# EAGLE design barometer (EAGLE 7.0.0)
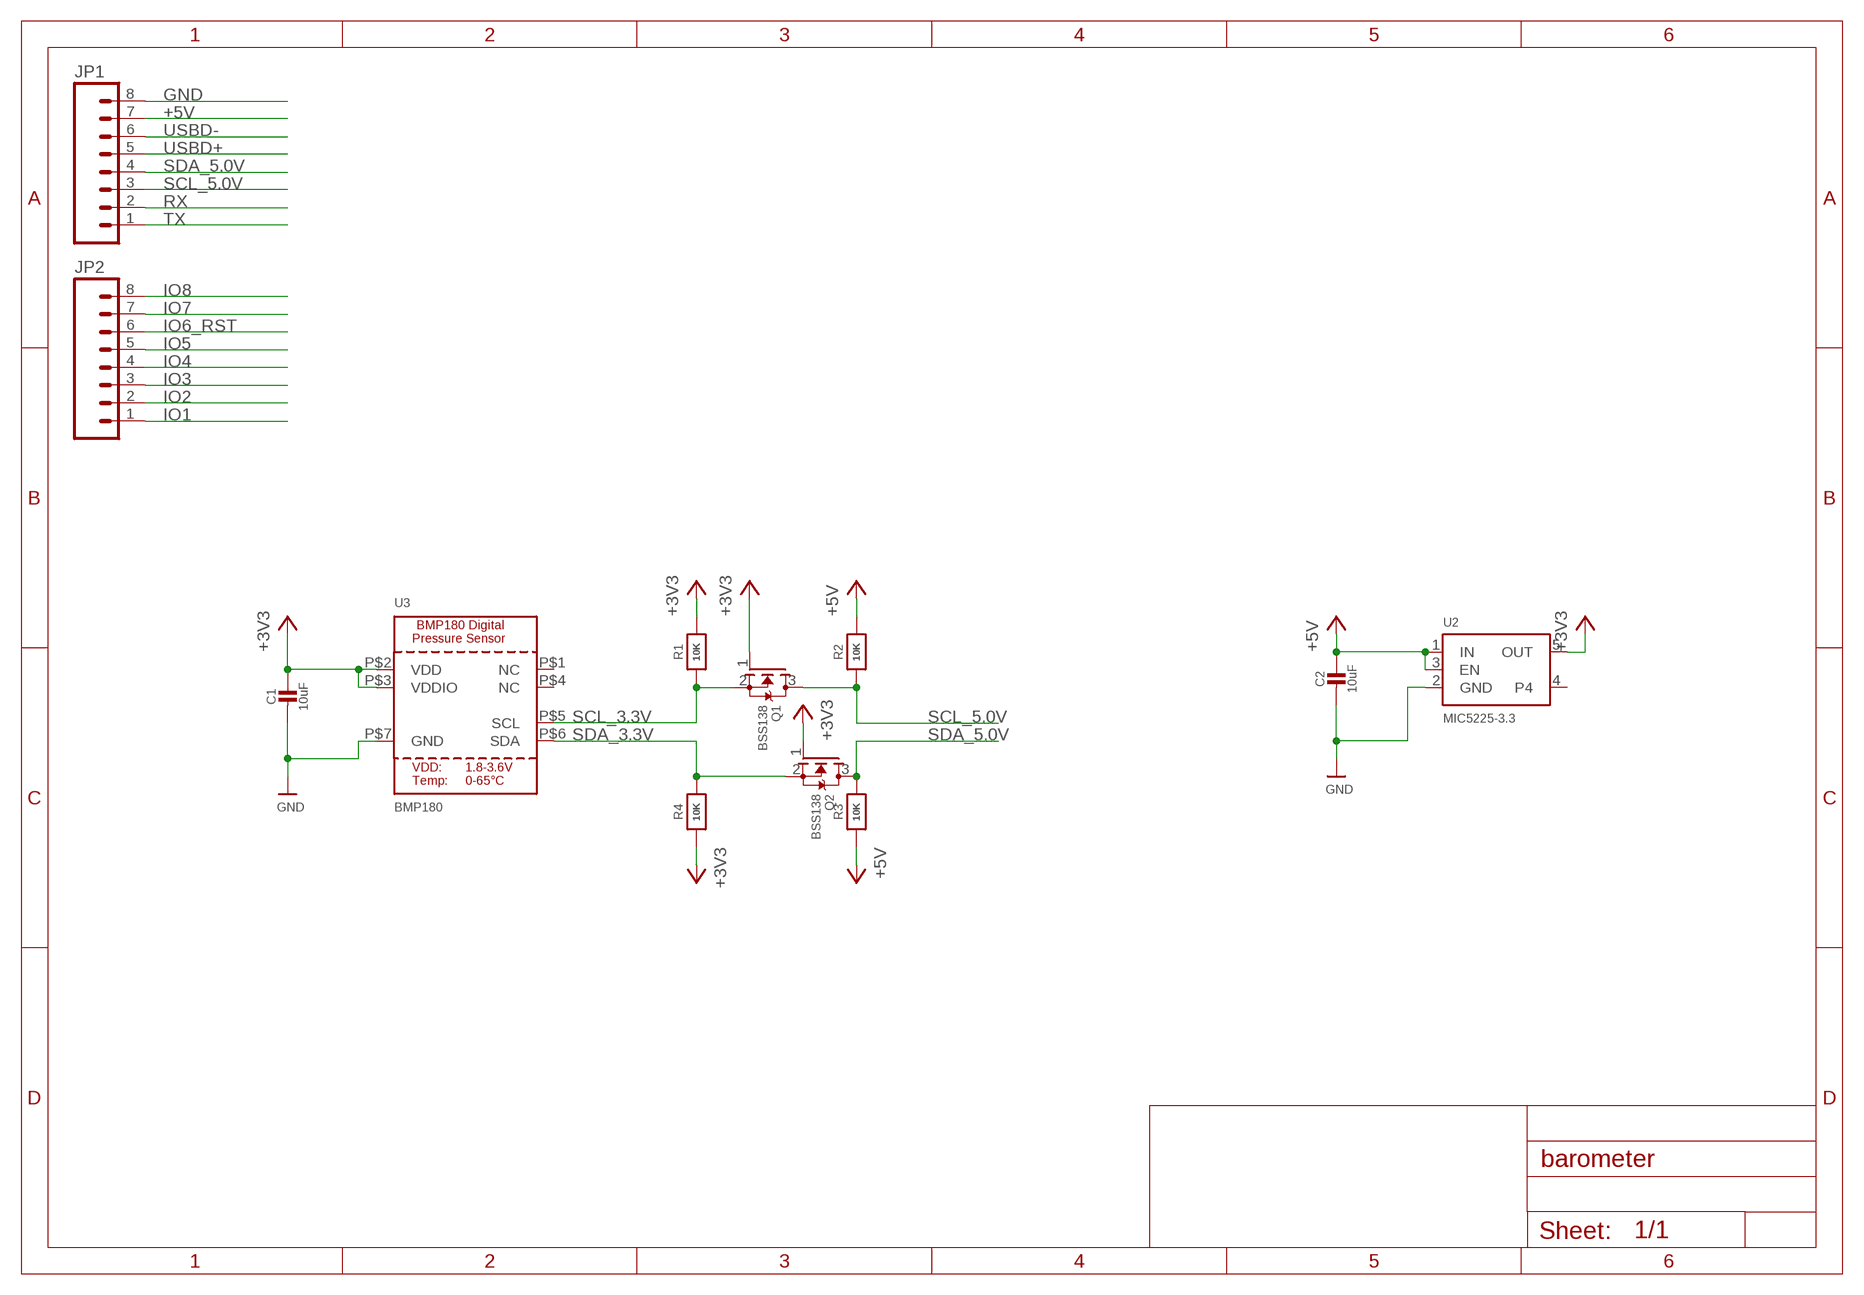
[diagram p0: schematic, sheet 1]

## Parts
C1  10uF  CAP_CERAMIC0805-NOOUTLINE  [0805-NO]
C2  10uF  CAP_CERAMIC0805-NOOUTLINE  [0805-NO]
JP1  M081X08  [1X08]
JP2  M081X08  [1X08]
Q1  BSS138  MOSFET-NREFLOW  [SOT23]
Q2  BSS138  MOSFET-NREFLOW  [SOT23]
R1  10K  RESISTOR0805_NOOUTLINE  [0805-NO]
R2  10K  RESISTOR_0805MP  [_0805MP]
R3  10K  RESISTOR0805_NOOUTLINE  [0805-NO]
R4  10K  RESISTOR0805_NOOUTLINE  [0805-NO]
U2  MIC5225-3.3  VREG_SOT23-5  [SOT23-5]
U3  BMP180  BMP180EXT  [BMP180_EXTENDED]

## Nets
+3V3: C1.1 Q1.1(G) Q2.1(G) R1.2 R4.1 U2.5(OUT) U3.P$2(VDD) U3.P$3(VDDIO)
+5V: C2.1 JP1.7 R2.2 R3.1 U2.1(IN) U2.3(EN)
GND: C1.2 C2.2 JP1.8 U2.2(GND) U3.P$7(GND)
IO1: JP2.1
IO2: JP2.2
IO3: JP2.3
IO4: JP2.4
IO5: JP2.5
IO6_RST: JP2.6
IO7: JP2.7
IO8: JP2.8
RX: JP1.2
SCL_3.3V: Q1.2(S) R1.1 U3.P$5(SCL)
SCL_5.0V: JP1.3 Q1.3(D) R2.1
SDA_3.3V: Q2.2(S) R4.2 U3.P$6(SDA)
SDA_5.0V: JP1.4 Q2.3(D) R3.2
TX: JP1.1
USBD+: JP1.5
USBD-: JP1.6
Unconnected: U2.4 U3.P$1(NC) U3.P$4(NC)

## Library data of the parts
C1 C2 = microbuilder:CAP_CERAMIC: Ceramic Capacitors For new designs, use the packages preceded by an '_' character since they are more reliable: The following footprints should be used on most boards: _0402 - Standard footprint for regular board layouts _0603 - Standard footprint for regular board layouts _0805 - Standard footprint for regular board layouts _1206 - Standard footprint for regular board layouts For extremely tight-pitch boards where space is at a premium, the following 'micro-pitch' footprints can be used (smaller pads, no silkscreen outline, etc.): _0402MP - Micro-pitch footprint for very dense/compact boards _0603MP - Micro-pitch footprint for very dense/compact boards _0805MP - Micro-pitch footprint for very dense/compact boards _1206MP - Micro-pitch footprint for very dense/compact boards
JP1 JP2 = SparkFun-Connectors:M08: Header 8 Standard 8-pin 0.1" header. Use with straight break away headers (SKU : PRT-00116), right angle break away headers (PRT-00553), swiss pins (PRT-00743), machine pins (PRT-00117), and female headers (PRT-00115).
Q1 Q2 = adafruit:MOSFET-N: N-Channel Mosfet 2N7002E - 60V 260mA SOT23 [Digikey: 2N7002ET1GOSTR-ND] - REEL BSH103 - 30V 850mA SOT23 [Digikey: 568-5013-1-ND]
R1-R4 = microbuilder:RESISTOR: Resistors For new designs, use the packages preceded by an '_' character since they are more reliable: The following footprints should be used on most boards: _0402 - Standard footprint for regular board layouts _0603 - Standard footprint for regular board layouts _0805 - Standard footprint for regular board layouts _1206 - Standard footprint for regular board layouts For extremely tight-pitch boards where space is at a premium, the following 'micro-pitch' footprints can be used (smaller pads, no silkscreen outline, etc.): _0402MP - Micro-pitch footprint for very dense/compact boards _0603MP - Micro-pitch footprint for very dense/compact boards _0805MP - Micro-pitch footprint for very dense/compact boards _1206MP - Micro-pitch footprint for very dense/compact boards
U2 = microbuilder:VREG_SOT23-5: SOT23-5 Fixed Voltage Regulators Part Current Out V Out V In V Dropout θJA (°C/W) TJ (°C) Digikey Part No. ADP121 150mA 3.3V 3.4-5.5V 0.09V @ 150mA -- -- ADP121-AUJZ33R7CT-ND ADP121 150mA 3.0V 3.1-5.5V 0.09V @ 150mA -- -- ADP121-AUJZ30R7CT-ND ADP122 300mA 3.3V 3.4-5.5V 0.085V @ 300mA -- -- ADP122AUJZ-3.3-R7CT-ND ADP1712 300mA 3.3V 3.5-5.5V 0.17V @ 300mA -- -- ADP1712AUJZ-3.3-R7TR-ND AP7311 (Low Cost) 150mA 3.3V 3.5-6V 0.15V @ 150mA -- -- AP7311-33WG-7DICT-ND LD39015M18R 150mA 1.8V 1.9V-5.5V 0.08V @ 100mA -- -- 497-6977-1-ND LP2985A-33DBVR 150mA 3.3V 3.3-16V 0.28V @ 150mA 206 150 296-18479-1-ND MCP1824T-3302E/OT 300mA 3.3V 3.5V-6V 0.2V @ 300mA -- -- MCP1824T-3302E/OTCT-ND MIC5205-2.5YM5 TR 150mA 2.5V 2.7-16V 0.165V @ 150mA -- -- 576-1257-2-ND MIC5205-3.0YM5 TR 150mA 3.0V 3.2V-16V 0.165V @ 150mA -- -- 576-1258-2-ND MIC5205-3.3YM5 TR 150mA 3.3V 3.5V-16V 0.165V @ 150mA -- -- 576-1259-2-ND TPS780330220 150mA 3.3V+2.2V 3.6-5.5V 250mV Max -- -- 296-23332-1-ND TDA3663/N1,135 100mA 3.3V 3.5-45V 0.18V @ 50mA -- -- 568-5343-1-ND Max operating temp can be calculated using θJA, TJ (max junction temperature), and power in watts. Set the "Maximum Ambient Temperature" until it reaches TJ ("Max Junction Temperature"), which is the absolute limit for safe use of the regulator: Heat Sink Temperature Calculator <http://www.daycounter.com/Calculators/Heat-Sink-Temperature-Calculator.phtml> For example, With 12V source into a 3.3V LP2985 and a 30mA load, we are dissipating (12V-3.3V) * 0.03A = 0.261W. With a θJA of 206 °C/W, a TJ of 150°C, and 261mW we can safely use the chip without a heat sink up to 75°C (=147.1°C Junction Temperature).
U3 = microbuilder:BMP180: BMP180 Digital Pressure Sensor 1.8-3.6V Supply, I2C Interface

## Board
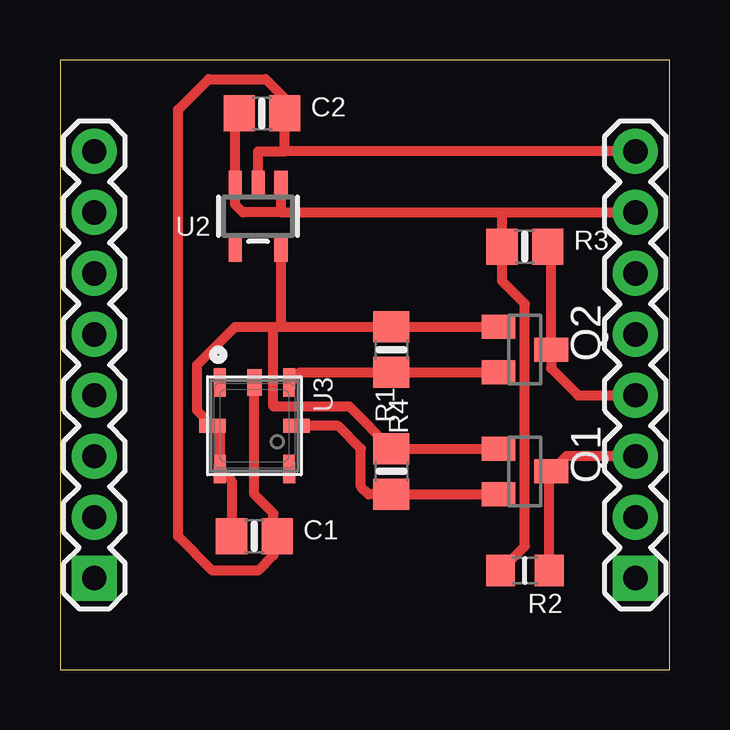
[diagram p1: board, top side]

Size 25.4 x 25.4 mm. Coordinates in mm from the lower left corner, seen from the top.
Outline: 0,0 25.4,0 25.4,25.4 0,25.4 0,0
Copper layers (1*16): Top 0.0356mm / dielectric 1.5011mm / Bottom 0.0356mm
Design rules "LaenPCBOrder": minimum track width 6mil, minimum drill 13mil, track to track 6mil, track to pad 6mil, pad to pad 6mil, via to via 6mil, smd to smd 6mil, copper to edge 15mil, drill to drill 6mil, minimum pad ring 7mil, minimum via ring 7mil, stop-mask expansion 3mil, vias tented up to drill 0mil, thermal gap 10mil

### Footprints (pad centres in the part's own frame; a part is rotated, then mirrored left to right if it is on the bottom)
0805-NO = smd 1.3 x 1.5: 1 -0.95,0; 2 0.95,0
1X08 = drill 1.016 pad 1.88 square: 1 0,0 | drill 1.016 pad 1.88: 2 2.54,0; 3 5.08,0; 4 7.62,0; 5 10.16,0; 6 12.7,0; 7 15.24,0; 8 17.78,0
SOT23 = smd 1 x 1.4: 1 -0.95,-1.1; 2 0.95,-1.1; 3 0,1.1
_0805MP = smd 1.2 x 1.3: 1 -1.016,0; 2 1.016,0
SOT23-5 = smd 0.55 x 1.2: 1 -0.95,-1.3; 2 0,-1.3; 3 0.95,-1.3; 4 0.95,1.3; 5 -0.95,1.3
BMP180_EXTENDED = smd 1.2 x 0.5: P$1 -1.8,-1.45; P$3 1.8,-1.45; P$4 1.8,1.45; P$6 -1.8,1.45 | smd 0.6 x 1.1: P$2 0,-1.75; P$5 0,1.75 | smd 1.1 x 0.6: P$7 -1.8,0

### Placement (x,y rotation side)
C1  8.1,5.56 0 top
C2  8.41,23.18 0 top
JP1  23.97,3.81 90 top
JP2  1.43,3.81 90 top
Q1  19.37,8.26 270 top
Q2  19.37,13.34 270 top
R1  13.81,8.26 90 top
R2  19.37,4.13 180 top
R3  19.37,17.62 0 top
R4  13.81,13.34 270 top
U2  8.26,18.89 180 top
U3  8.1,10.16 270 top

### Tracks (layer width: path | path; a pad name or v marks a point on that pad's centre or on a via)
+3V3
  Top 0.406: U2.5 9.21,14.29 | 9.21,14.29 R4.1 Q2.1 | Q1.1 R1.2 12.06,10.95 8.89,10.95 8.89,14.29 | C1.1 7.15,7.86 U3.P$3 6.65,9.86 U3.P$2 5.71,10.79 5.71,12.7 7.3,14.29 8.89,14.29 | 8.89,14.29 9.21,14.29
+5V
  Top 0.406: 18.42,19.05 R3.1 18.42,16.19 19.37,15.24 19.37,5.14 R2.2 | 18.42,19.05 JP1.7 | 9.21,19.05 18.42,19.05 | U2.1 9.21,19.05 | C2.1 7.3,23.18 U2.3 7.3,19.37 7.62,19.05 9.21,19.05
GND
  Top 0.406: U2.2 8.26,21.59 9.37,21.59 | 9.37,21.59 C2.2 9.36,23.82 8.57,24.61 6.19,24.61 4.92,23.34 4.92,5.56 6.35,4.13 8.26,4.13 8.89,4.76 8.89,5.4 C1.2 8.89,5.71 8.89,6.51 8.1,7.3 U3.P$7 | JP1.8 9.37,21.59
SCL_3.3V
  Top 0.406: Q1.2 R1.1 12.86,7.3 12.54,7.62 12.54,9.21 11.59,10.16 U3.P$5
SCL_5.0V
  Top 0.406: R2.1 20.38,8.26 Q1.3 21.1,8.89 JP1.3
SDA_3.3V
  Top 0.406: Q2.2 R4.2 9.97,12.38 U3.P$6
SDA_5.0V
  Top 0.406: R3.2 20.47,17.62 Q2.3 20.47,12.55 21.59,11.43 JP1.4